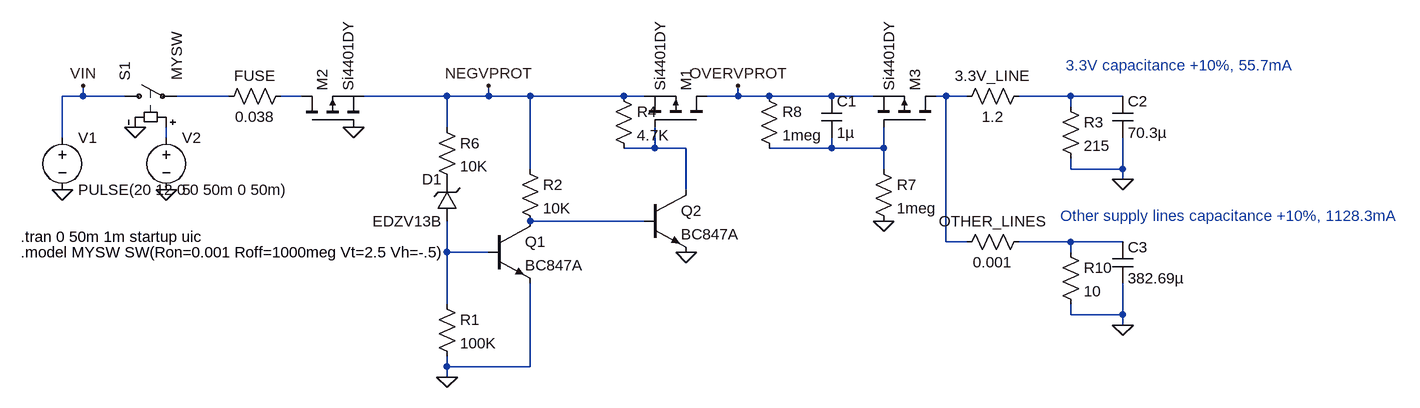
[diagram p0: schematic InputVoltage.asc]
InputVoltage.asc, the LTspice schematic file:
Version 4
SHEET 1 1536 680
WIRE -512 32 -512 16
WIRE -512 32 -544 32
WIRE -448 32 -512 32
WIRE -288 32 -368 32
WIRE -176 32 -208 32
WIRE 48 32 -80 32
WIRE 112 32 112 16
WIRE 112 32 48 32
WIRE 176 32 112 32
WIRE 320 32 176 32
WIRE 352 32 320 32
WIRE 496 32 496 16
WIRE 496 32 448 32
WIRE 544 32 496 32
WIRE 640 32 544 32
WIRE 704 32 640 32
WIRE 816 32 800 32
WIRE 848 32 816 32
WIRE 1008 32 928 32
WIRE 1088 32 1008 32
WIRE 1008 48 1008 32
WIRE 48 80 48 32
WIRE -544 96 -544 32
WIRE -384 96 -384 80
WIRE 368 112 368 80
WIRE 368 112 320 112
WIRE 416 112 368 112
WIRE 640 112 640 96
WIRE 640 112 544 112
WIRE 720 112 720 80
WIRE 720 112 640 112
WIRE 176 144 176 32
WIRE 720 144 720 112
WIRE 1008 144 1008 128
WIRE 1088 144 1088 96
WIRE 1088 144 1008 144
WIRE 1088 160 1088 144
WIRE 416 176 416 112
WIRE 352 224 176 224
WIRE 816 256 816 32
WIRE 848 256 816 256
WIRE 1008 256 928 256
WIRE 1088 256 1008 256
WIRE 48 272 48 224
WIRE 112 272 48 272
WIRE 1008 272 1008 256
WIRE 48 352 48 272
WIRE 1008 368 1008 352
WIRE 1088 368 1088 320
WIRE 1088 368 1008 368
WIRE 1088 384 1088 368
WIRE 48 448 48 432
WIRE 176 448 176 320
WIRE 176 448 48 448
WIRE 48 464 48 448
FLAG 48 464 0
FLAG -544 176 0
FLAG 1088 160 0
FLAG 416 272 0
FLAG -96 80 0
FLAG 720 224 0
FLAG 1088 384 0
FLAG -384 176 0
FLAG -432 80 0
FLAG 496 16 OVERVPROT
FLAG -512 16 VIN
FLAG 112 16 NEGVPROT
SYMBOL npn 112 224 R0
SYMATTR InstName Q1
SYMATTR Value BC847A
SYMBOL zener 64 224 R180
WINDOW 0 24 64 Left 2
WINDOW 3 24 0 Left 2
SYMATTR InstName D1
SYMATTR Value EDZV13B
SYMATTR Description Diode
SYMATTR Type diode
SYMBOL res 32 336 R0
SYMATTR InstName R1
SYMATTR Value 100K
SYMBOL res 160 128 R0
SYMATTR InstName R2
SYMATTR Value 10K
SYMBOL voltage -544 80 R0
WINDOW 123 0 0 Left 2
WINDOW 39 0 0 Left 2
SYMATTR InstName V1
SYMATTR Value PULSE(20 12 0 0 50m 0 50m)
SYMBOL res 992 32 R0
SYMATTR InstName R3
SYMATTR Value 215
SYMBOL res 32 64 R0
SYMATTR InstName R6
SYMATTR Value 10K
SYMBOL pmos 448 80 M270
SYMATTR InstName M1
SYMATTR Value Si4401DY
SYMBOL npn 352 176 R0
SYMATTR InstName Q2
SYMATTR Value BC847A
SYMBOL res 304 16 R0
SYMATTR InstName R4
SYMATTR Value 4.7K
SYMBOL res -192 16 R90
WINDOW 0 0 56 VBottom 2
WINDOW 3 32 56 VTop 2
SYMATTR InstName FUSE
SYMATTR Value 0.038
SYMBOL pmos 800 80 M270
SYMATTR InstName M3
SYMATTR Value Si4401DY
SYMBOL res 704 128 R0
SYMATTR InstName R7
SYMATTR Value 1meg
SYMBOL res 528 16 R0
SYMATTR InstName R8
SYMATTR Value 1meg
SYMBOL cap 624 32 R0
SYMATTR InstName C1
SYMATTR Value 1µ
SYMBOL cap 1072 32 R0
SYMATTR InstName C2
SYMATTR Value 70.3µ
SYMATTR SpiceLine Rser=0.5
SYMBOL pmos -176 80 R270
SYMATTR InstName M2
SYMATTR Value Si4401DY
SYMBOL res 944 16 R90
WINDOW 0 0 56 VBottom 2
WINDOW 3 32 56 VTop 2
SYMATTR InstName 3.3V_LINE
SYMATTR Value 1.2
SYMBOL res 992 256 R0
SYMATTR InstName R10
SYMATTR Value 10
SYMBOL cap 1072 256 R0
SYMATTR InstName C3
SYMATTR Value 382.69µ
SYMATTR SpiceLine Rser=1
SYMBOL sw -464 32 R270
SYMATTR InstName S1
SYMATTR Value MYSW
SYMBOL voltage -384 80 R0
WINDOW 123 0 0 Left 2
WINDOW 39 0 0 Left 2
SYMATTR InstName V2
SYMATTR Value 5
SYMBOL res 944 240 R90
WINDOW 0 0 56 VBottom 2
WINDOW 3 32 56 VTop 2
SYMATTR InstName OTHER_LINES
SYMATTR Value 0.001
TEXT -608 248 Left 2 !.tran 0 50m 1m startup uic
TEXT 1000 -16 Left 2 ;3.3V capacitance +10%, 55.7mA
TEXT 992 216 Left 2 ;Other supply lines capacitance +10%, 1128.3mA
TEXT -608 272 Left 2 !.model MYSW SW(Ron=0.001 Roff=1000meg Vt=2.5 Vh=-.5)

The netlist it stands for:
* InputVoltage.asc
Q1 N008 N010 0 0 BC847A
D1 N010 P001 EDZV13B
R1 N010 0 100K
R2 NEGVPROT N008 10K
V1 VIN 0 PULSE(20 12 0 0 50m 0 50m)
R3 N004 0 215
R6 NEGVPROT P001 10K
M1 OVERVPROT N006 NEGVPROT NEGVPROT Si4401DY
Q2 N006 N008 0 0 BC847A
R4 NEGVPROT N006 4.7K
R§FUSE N002 N001 0.038
M3 N003 N007 OVERVPROT OVERVPROT Si4401DY
R7 N007 0 1meg
R8 OVERVPROT N007 1meg
C1 OVERVPROT N007 1µ
C2 N004 0 70.3µ Rser=0.5
M2 N002 0 NEGVPROT NEGVPROT Si4401DY
R§3.3V_LINE N004 N003 1.2
R10 N009 0 10
C3 N009 0 382.69µ Rser=1
S1 VIN N001 N005 0 MYSW
V2 N005 0 5
R§OTHER_LINES N009 N003 0.001
.model D D
.lib standard.dio
.model NPN NPN
.model PNP PNP
.lib standard.bjt
.model NMOS NMOS
.model PMOS PMOS
.lib standard.mos
.tran 0 50m 1m startup uic
* 3.3V capacitance +10%, 55.7mA
* Other supply lines capacitance +10%, 1128.3mA
.model MYSW SW(Ron=0.001 Roff=1000meg Vt=2.5 Vh=-.5)
.backanno
.end

* Results of the author's LTspice run, read from the files saved beside the schematic
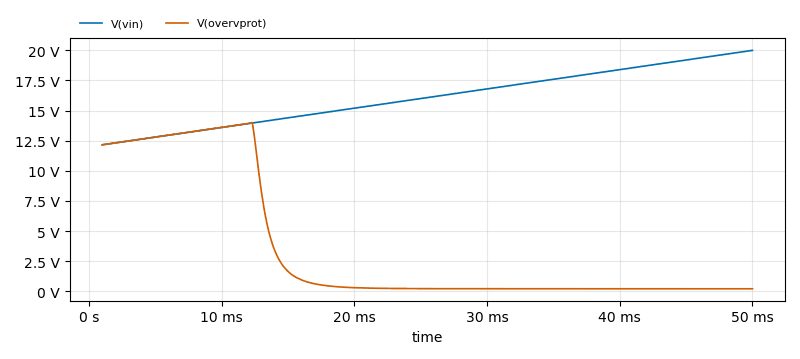
[diagram p1: Transient Analysis of InputVoltage.asc, plotted from the saved traces]
* Transient Analysis, 1 run:
*   V(vin): min 12.16 V, max 20 V, average 16.08 V, rms 16.24 V, last 20 V
*   V(overvprot): min 211 mV, max 14.01 V, average 3.535 V, rms 6.49 V, last 211 mV